# EAGLE design main (EAGLE 9.6.2)
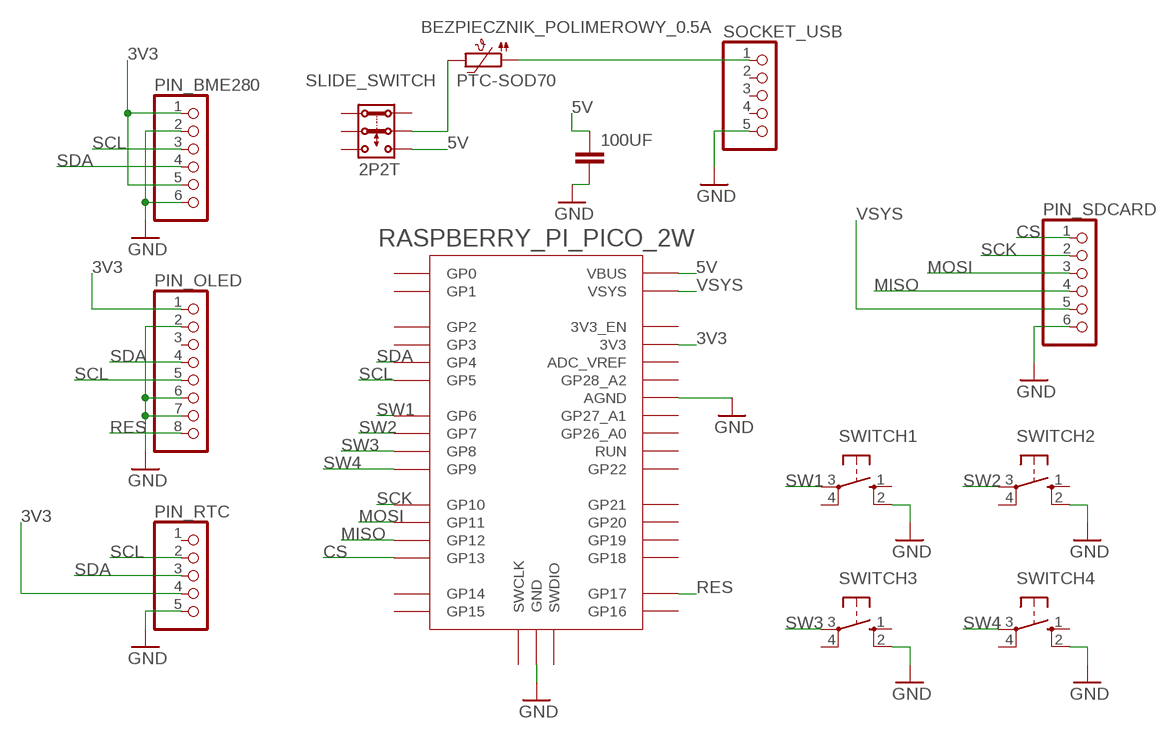
[diagram p0: schematic, sheet 1]

## Parts
100UF  C2,5-3  [C2.5-3]
BEZPIECZNIK_POLIMEROWY_0.5A  PTC-SOD70  [SOD70]
PIN_BME280  PINHD-1X6  [1X06]
PIN_OLED  PINHD-1X8  [1X08]
PIN_RTC  PINHD-1X5  [1X05]
PIN_SDCARD  PINHD-1X6  [1X06]
RASPBERRY_PI_PICO_2W  RPI_PICO-TH  [RPI_PICO_TH]
SLIDE_SWITCH  2P2T  [2P2T]
SOCKET_USB  PINHD-1X5  [1X05]
SWITCH1  10-XX  [B3F-10XX]
SWITCH2  10-XX  [B3F-10XX]
SWITCH3  10-XX  [B3F-10XX]
SWITCH4  10-XX  [B3F-10XX]

## Nets
3V3: PIN_BME280.1 PIN_BME280.5 PIN_OLED.1 PIN_RTC.4 RASPBERRY_PI_PICO_2W.3V3
5V: 100UF.1 RASPBERRY_PI_PICO_2W.VBUS SLIDE_SWITCH.3.1
CS: PIN_SDCARD.1 RASPBERRY_PI_PICO_2W.GP13
GND: 100UF.2 PIN_BME280.2 PIN_BME280.6 PIN_OLED.2 PIN_OLED.6 PIN_OLED.7 PIN_RTC.5 PIN_SDCARD.6 RASPBERRY_PI_PICO_2W.AGND RASPBERRY_PI_PICO_2W.GND@1(GND) RASPBERRY_PI_PICO_2W.GND@2(GND) RASPBERRY_PI_PICO_2W.GND@3(GND) RASPBERRY_PI_PICO_2W.GND@4(GND) RASPBERRY_PI_PICO_2W.GND@5(GND) RASPBERRY_PI_PICO_2W.GND@6(GND) RASPBERRY_PI_PICO_2W.GND@7(GND) RASPBERRY_PI_PICO_2W.GND@8(GND) SOCKET_USB.5 SWITCH1.2(S1) SWITCH2.2(S1) SWITCH3.2(S1) SWITCH4.2(S1)
MISO: PIN_SDCARD.4 RASPBERRY_PI_PICO_2W.GP12
MOSI: PIN_SDCARD.3 RASPBERRY_PI_PICO_2W.GP11
N$1: BEZPIECZNIK_POLIMEROWY_0.5A.1 SOCKET_USB.1
N$2: BEZPIECZNIK_POLIMEROWY_0.5A.2 SLIDE_SWITCH.2.1
RES: PIN_OLED.8 RASPBERRY_PI_PICO_2W.GP17
SCK: PIN_SDCARD.2 RASPBERRY_PI_PICO_2W.GP10
SCL: PIN_BME280.3 PIN_OLED.5 PIN_RTC.2 RASPBERRY_PI_PICO_2W.GP5
SDA: PIN_BME280.4 PIN_OLED.4 PIN_RTC.3 RASPBERRY_PI_PICO_2W.GP4
SW1: RASPBERRY_PI_PICO_2W.GP6 SWITCH1.3(P)
SW2: RASPBERRY_PI_PICO_2W.GP7 SWITCH2.3(P)
SW3: RASPBERRY_PI_PICO_2W.GP8 SWITCH3.3(P)
SW4: RASPBERRY_PI_PICO_2W.GP9 SWITCH4.3(P)
VSYS: PIN_SDCARD.5 RASPBERRY_PI_PICO_2W.VSYS
Unconnected: PIN_OLED.3 PIN_RTC.1 RASPBERRY_PI_PICO_2W.3V3_EN RASPBERRY_PI_PICO_2W.ADC_VREF RASPBERRY_PI_PICO_2W.GP0 RASPBERRY_PI_PICO_2W.GP1 RASPBERRY_PI_PICO_2W.GP2 RASPBERRY_PI_PICO_2W.GP3 RASPBERRY_PI_PICO_2W.GP14 RASPBERRY_PI_PICO_2W.GP15 RASPBERRY_PI_PICO_2W.GP16 RASPBERRY_PI_PICO_2W.GP18 RASPBERRY_PI_PICO_2W.GP19 RASPBERRY_PI_PICO_2W.GP20 RASPBERRY_PI_PICO_2W.GP21 RASPBERRY_PI_PICO_2W.GP22 RASPBERRY_PI_PICO_2W.GP26_A0 RASPBERRY_PI_PICO_2W.GP27_A1 RASPBERRY_PI_PICO_2W.GP28_A2 RASPBERRY_PI_PICO_2W.RUN RASPBERRY_PI_PICO_2W.SWCLK RASPBERRY_PI_PICO_2W.SWDIO SLIDE_SWITCH.1.1 SLIDE_SWITCH.1.2 SLIDE_SWITCH.2.2 SLIDE_SWITCH.3.2 SOCKET_USB.2 SOCKET_USB.3 SOCKET_USB.4 SWITCH1.1(S) SWITCH1.4(P1) SWITCH2.1(S) SWITCH2.4(P1) SWITCH3.1(S) SWITCH3.4(P1) SWITCH4.1(S) SWITCH4.4(P1)

## Library data of the parts
100UF = capacitor-wima:C: CAPACITOR naming: grid - package width
BEZPIECZNIK_POLIMEROWY_0.5A = ptc-ntc:PTC-: Positive Temperature Coefficient Resistor (PTC) termistor Philips KTY81-210 - KTY81-252 Source: 153627-da-01-en-Temperatur-Sensor_KTY10-6_Philips.pdf; OC_FARNELL: unknown; OC_NEWARK: unknown
PIN_BME280 PIN_SDCARD = pinhead:PINHD-1X6: PIN HEADER
PIN_OLED = pinhead:PINHD-1X8: PIN HEADER
PIN_RTC SOCKET_USB = pinhead:PINHD-1X5: PIN HEADER
RASPBERRY_PI_PICO_2W = RaspberryPi_Pico:RPI_PICO
SLIDE_SWITCH = switch:2P2T: SLIDE SWITCH 2P2T Part No. SS-22F05-G(A)4 Source: CANAL ELECTRONIC CO., LTD .. switsch.pdf
SWITCH1-SWITCH4 = switch-omron:10-XX: OMRON SWITCH; MPN: B3F-1000; OC_FARNELL: 176432; OC_NEWARK: 36M3542

## Board
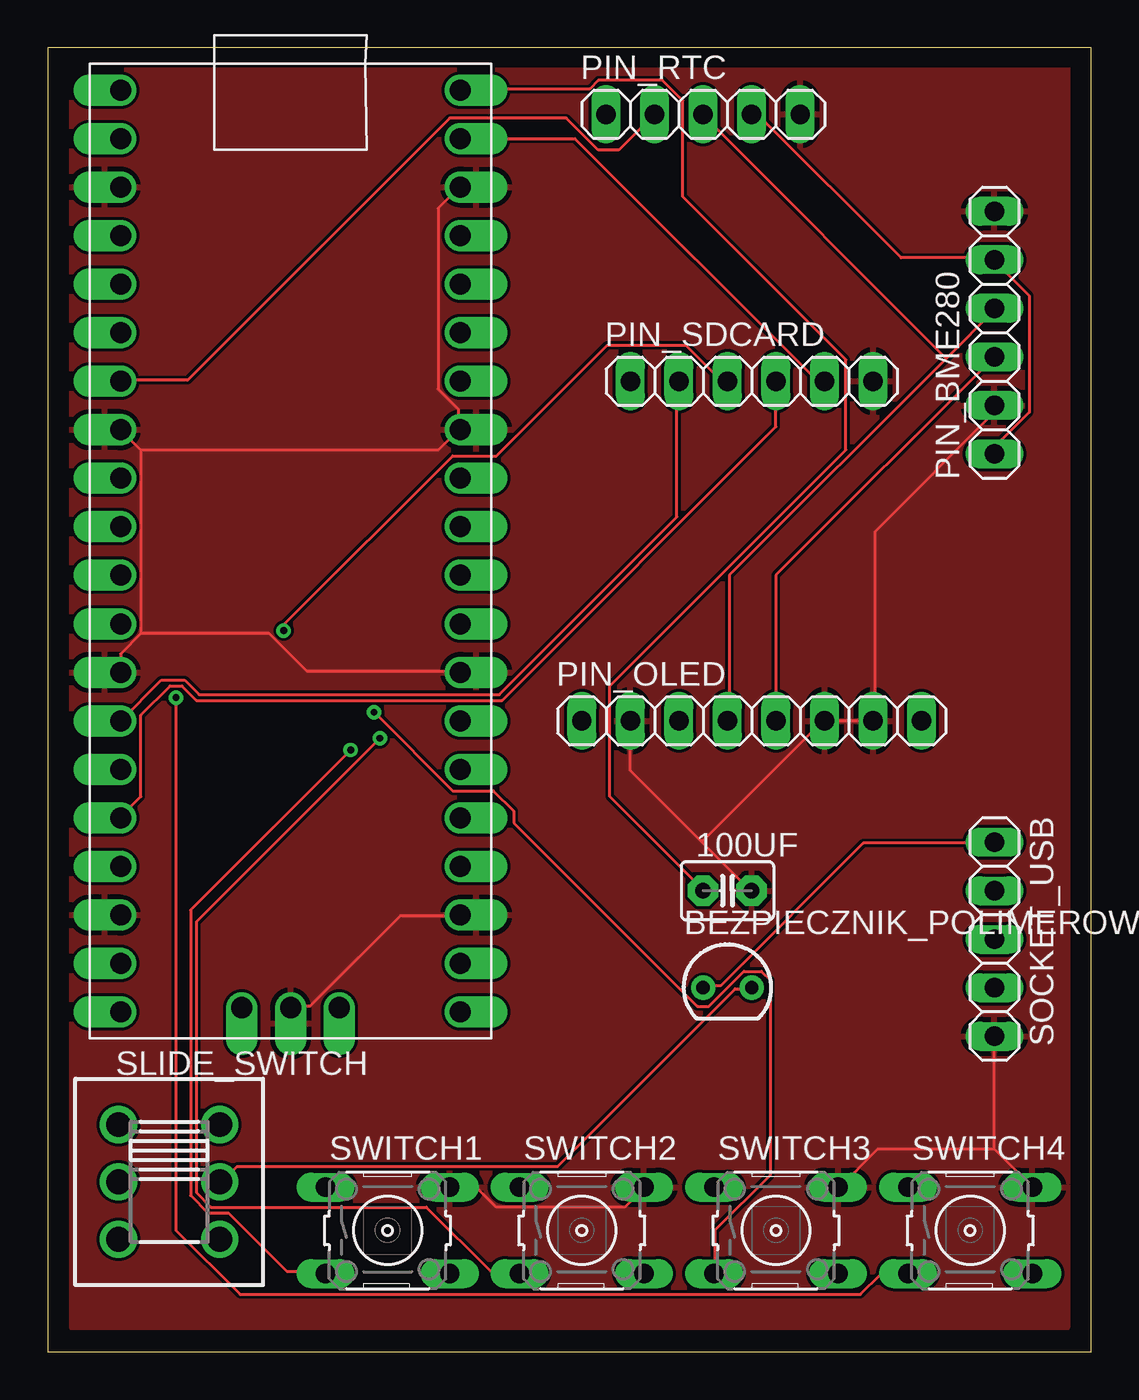
[diagram p1: board, top side]
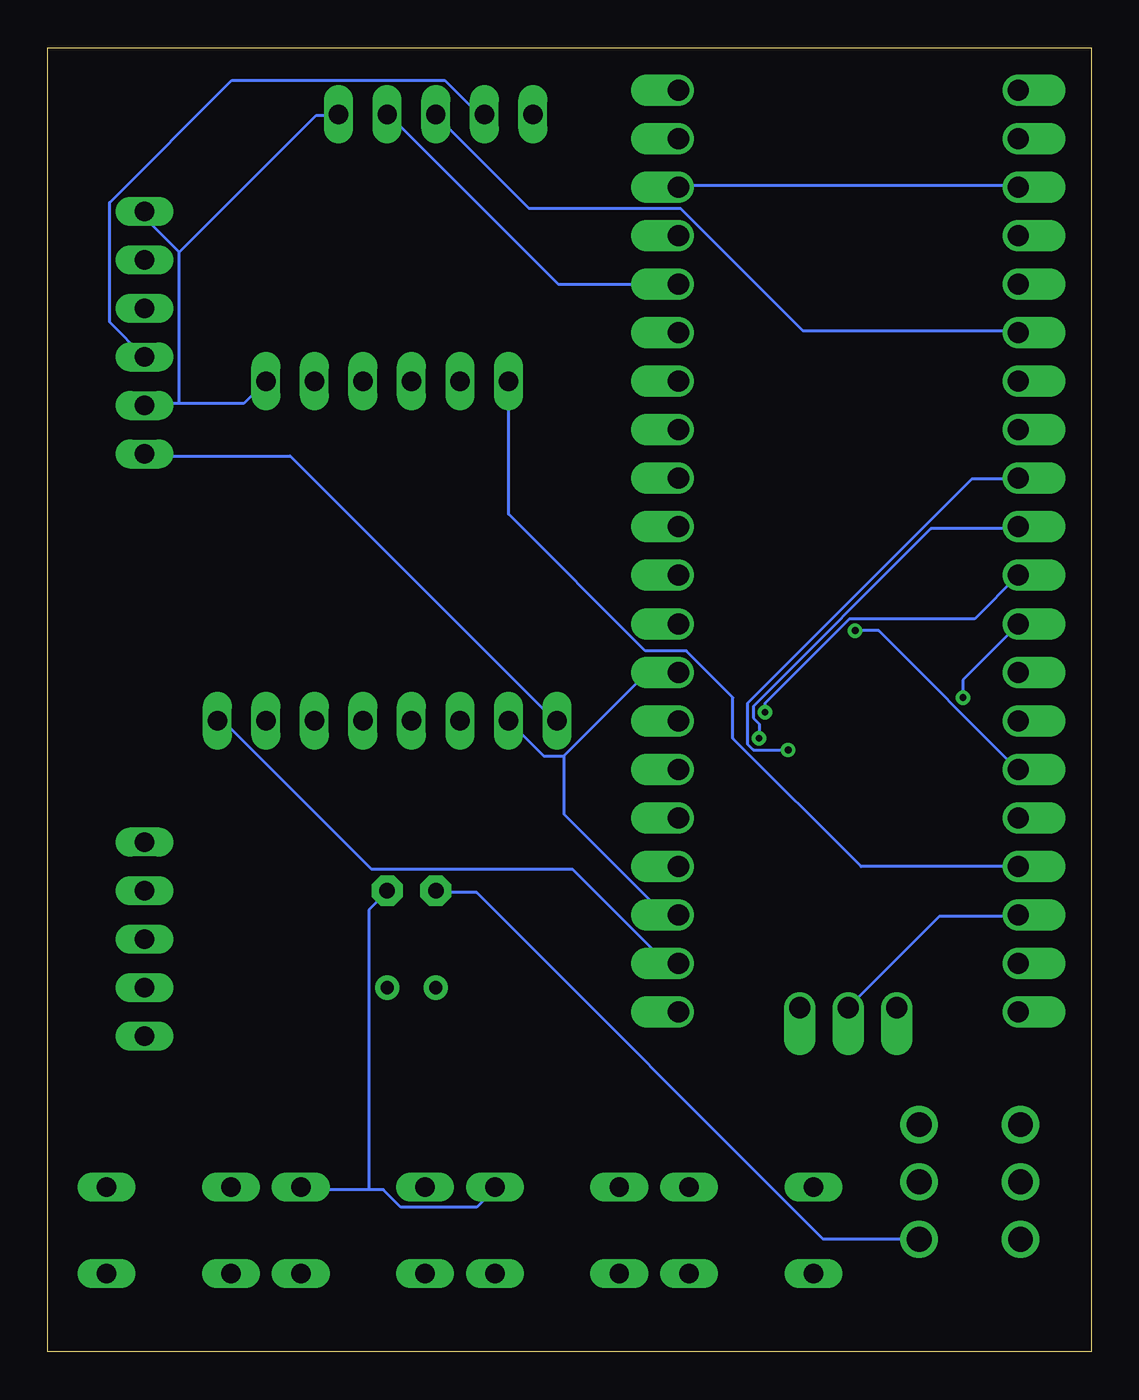
[diagram p2: board, bottom side, seen from below]

Size 54.59 x 68.25 mm. Coordinates in mm from the lower left corner, seen from the top.
Outline: 0,0 54.59,0 54.59,68.25 0,68.25 0,0
Copper layers (1*16): Top 0.035mm / dielectric 1.5mm / Bottom 0.035mm
Design rules "default": minimum track width 6mil, minimum drill 0.35mm, track to track 6mil, track to pad 6mil, pad to pad 6mil, via to via 6mil, smd to smd 6mil, copper to edge 40mil, drill to drill 6mil, minimum pad ring 10mil, minimum via ring 8mil, stop-mask expansion 4mil, vias tented up to drill 0mil, thermal gap 10mil

### Footprints (pad centres in the part's own frame; a part is rotated, then mirrored left to right if it is on the bottom)
C2.5-3 = drill 0.813 pad 1.6 octagon: 1 -1.27,0; 2 1.27,0
SOD70 = drill 0.7 pad 1.27: 1 -1.27,0; 2 1.27,0
1X06 = drill 1.016 long: 1 -6.35,0; 2 -3.81,0; 3 -1.27,0; 4 1.27,0; 5 3.81,0; 6 6.35,0
1X08 = drill 1.016 long: 1 -8.89,0; 2 -6.35,0; 3 -3.81,0; 4 -1.27,0; 5 1.27,0; 6 3.81,0; 7 6.35,0; 8 8.89,0
1X05 = drill 1.016 long: 1 -5.08,0; 2 -2.54,0; 3 0,0; 4 2.54,0; 5 5.08,0
RPI_PICO_TH = drill 1.1 pad 1.6 offset: 3V3 8.89,13.97; 3V3_EN 8.89,16.51; ADC_VREF 8.89,11.43; AGND 8.89,6.35; GND@1 -8.89,19.05; GND@2 -8.89,6.35; GND@3 -8.89,-6.35; GND@4 -8.89,-19.05; GND@5 0,-23.9; GND@6 8.89,-19.05; GND@7 8.89,-6.35; GND@8 8.89,19.05; GP0 -8.89,24.13; GP1 -8.89,21.59; GP2 -8.89,16.51; GP3 -8.89,13.97; GP4 -8.89,11.43; GP5 -8.89,8.89; GP6 -8.89,3.81; GP7 -8.89,1.27; GP8 -8.89,-1.27; GP9 -8.89,-3.81; GP10 -8.89,-8.89; GP11 -8.89,-11.43; GP12 -8.89,-13.97; GP13 -8.89,-16.51; GP14 -8.89,-21.59; GP15 -8.89,-24.13; GP16 8.89,-24.13; GP17 8.89,-21.59; GP18 8.89,-16.51; GP19 8.89,-13.97; GP20 8.89,-11.43; GP21 8.89,-8.89; GP22 8.89,-3.81; GP26_A0 8.89,1.27; GP27_A1 8.89,3.81; GP28_A2 8.89,8.89; RUN 8.89,-1.27; SWCLK -2.54,-23.9; SWDIO 2.54,-23.9; VBUS 8.89,24.13; VSYS 8.89,21.59
2P2T = drill 1.3 pad 1.93: 1.1 -3,2.65; 1.2 -3,-2.65; 2.1 0,2.65; 2.2 0,-2.65; 3.1 3,2.65; 3.2 3,-2.65
B3F-10XX = drill 1.016 long: 1 -3.251,2.261; 2 3.251,2.261; 3 -3.251,-2.261; 4 3.251,-2.261

### Placement (x,y rotation side)
100UF  35.56,24.13 0 top
BEZPIECZNIK_POLIMEROWY_0.5A  35.56,19.05 0 top
PIN_BME280  49.53,53.34 90 top
PIN_OLED  36.83,33.02 0 top
PIN_RTC  34.29,64.77 0 top
PIN_SDCARD  36.83,50.8 0 top
RASPBERRY_PI_PICO_2W  12.7,41.91 0 top
SLIDE_SWITCH  6.35,8.89 270 top
SOCKET_USB  49.53,21.59 270 top
SWITCH1  17.78,6.35 0 top
SWITCH2  27.94,6.35 0 top
SWITCH3  38.1,6.35 0 top
SWITCH4  48.26,6.35 0 top

### Tracks (layer width: path | path; a pad name or v marks a point on that pad's centre or on a via)
3V3
  Top 0.152: PIN_RTC.4 36.88,64.72 37.19,64.72 44.65,57.25 49.53,57.25 PIN_BME280.5 49.53,57.1 51.36,55.27 51.36,49.17 49.53,47.35 PIN_BME280.1
  Bottom 0.152: PIN_OLED.1 28.04,33.02 41.91,46.89 49.53,46.89 PIN_BME280.1 | RASPBERRY_PI_PICO_2W.3V3 27.89,55.88 36.73,64.72 PIN_RTC.4
5V
  Top 0.152: RASPBERRY_PI_PICO_2W.VBUS 21.64,66.09 28.35,66.09 28.8,66.55 32.16,66.55 33.22,65.48 33.22,60.45 41.76,51.92 41.76,47.19 29.41,34.85 29.41,29.06 34.29,24.18 100UF.1
  Bottom 0.152: 100UF.1 34.29,24.03 32.16,24.03 14.02,5.89 9.14,5.89 SLIDE_SWITCH.3.1
CS
  Bottom 0.152: PIN_SDCARD.1 30.48,43.84 23.32,36.68 21.18,36.68 18.75,34.24 18.75,32.11 12.04,25.4 RASPBERRY_PI_PICO_2W.GP13
GND
  Top 0.152: RASPBERRY_PI_PICO_2W.GND@3 3.81,36.53 4.88,37.59 | 4.88,47.19 4.88,37.59 | RASPBERRY_PI_PICO_2W.GND@2 4.88,47.19 | 21.49,48.26 21.49,49.33 20.42,50.39 20.42,59.84 21.49,60.91 RASPBERRY_PI_PICO_2W.GND@8 | 4.88,47.19 20.42,47.19 21.49,48.26 | 21.49,48.26 RASPBERRY_PI_PICO_2W.AGND | 49.53,10.62 SOCKET_USB.5 | 49.53,10.62 51.51,8.64 SWITCH4.2 | SWITCH1.2 21.03,8.48 22.55,8.48 23.47,7.57 30.18,7.57 31.09,8.48 SWITCH2.2 | 49.53,10.62 43.43,10.62 41.45,8.64 SWITCH3.2 | RASPBERRY_PI_PICO_2W.GND@5 12.8,18.09 13.72,18.09 18.44,22.81 21.49,22.81 RASPBERRY_PI_PICO_2W.GND@6 | PIN_OLED.2 30.48,30.43 34.14,26.77 | 34.14,26.77 36.73,24.18 100UF.2 | 34.14,26.77 34.29,26.77 40.54,33.02 PIN_OLED.6 PIN_OLED.7 43.28,33.02 43.28,42.93 49.53,49.17 PIN_BME280.2 | 4.88,37.59 11.58,37.59 13.56,35.61 21.49,35.61 RASPBERRY_PI_PICO_2W.GND@7
  Bottom 0.152: RASPBERRY_PI_PICO_2W.GND@1 3.81,61.06 21.49,61.06 RASPBERRY_PI_PICO_2W.GND@8 | 37.8,8.48 37.03,8.48 36.12,7.57 32.16,7.57 31.24,8.48 SWITCH2.2 | 37.8,8.48 41.3,8.48 SWITCH3.2 | 47.7,49.63 44.35,49.63 PIN_SDCARD.6 | 47.7,49.63 49.53,49.63 PIN_BME280.2 | PIN_BME280.6 49.53,59.39 47.7,57.56 | 47.7,49.63 47.7,57.56 | 47.7,57.56 40.54,64.72 39.47,64.72 PIN_RTC.5 | RASPBERRY_PI_PICO_2W.GND@4 3.81,22.81 7.92,22.81 12.65,18.09 RASPBERRY_PI_PICO_2W.GND@5 | 27.58,31.19 23.32,35.46 21.64,35.46 RASPBERRY_PI_PICO_2W.GND@7 | 27.58,31.19 28.65,31.19 PIN_OLED.2 | 27.58,31.19 27.58,28.14 22.4,22.96 21.64,22.96 RASPBERRY_PI_PICO_2W.GND@6 | 37.8,8.48 37.8,23.11 36.88,24.03 100UF.2
  pour Top: 1.27,67.31 53.34,67.31 53.34,1.27 1.27,1.27
MISO
  Top 0.152: PIN_SDCARD.4 38.1,48.41 23.77,34.09 7.77,34.09 7.01,34.85 6.4,34.85 4.88,33.33 4.88,29.06 3.81,27.99 RASPBERRY_PI_PICO_2W.GP12
MOSI  (via drill 0.35)
  Top 0.152: v12.34,37.74 12.34,38.05 21.18,46.89 23.47,46.89 29.26,52.68 33.38,52.68 35.2,50.85 35.51,50.85 PIN_SDCARD.3
  Bottom 0.152: v12.34,37.74 11.12,37.74 3.81,30.43 RASPBERRY_PI_PICO_2W.GP11
N$1
  Top 0.152: BEZPIECZNIK_POLIMEROWY_0.5A.1 34.29,19.15 35.2,19.15 42.67,26.62 49.53,26.62 SOCKET_USB.1
N$2
  Top 0.152: BEZPIECZNIK_POLIMEROWY_0.5A.2 36.73,19 35.97,19 26.67,9.7 9.91,9.7 9.14,8.94 SLIDE_SWITCH.2.1
RES
  Bottom 0.152: PIN_OLED.8 45.41,33.02 37.64,25.25 27.13,25.25 22.25,20.37 21.64,20.37 RASPBERRY_PI_PICO_2W.GP17
SCK
  Top 0.152: RASPBERRY_PI_PICO_2W.GP10 5.94,35.15 7.16,35.15 7.92,34.39 23.62,34.39 32.92,43.69 32.92,50.7 PIN_SDCARD.2
SCL
  Top 0.152: PIN_OLED.5 38.1,40.64 PIN_BME280.3 | PIN_RTC.2 29.87,62.89 28.8,62.89 27.13,64.57 21.03,64.57 7.32,50.85 3.81,50.85 RASPBERRY_PI_PICO_2W.GP5
  Bottom 0.152: PIN_BME280.3 51.36,53.9 51.36,60.15 44.96,66.55 33.83,66.55 32.16,64.87 31.85,64.87 PIN_RTC.2
SDA
  Top 0.152: 47.09,52.07 49.53,54.51 PIN_BME280.4 | 47.09,52.07 35.66,40.64 35.66,33.02 PIN_OLED.4 | 47.09,52.07 46.94,52.07 34.29,64.72 PIN_RTC.3
  Bottom 0.152: RASPBERRY_PI_PICO_2W.GP4 3.81,53.44 15.09,53.44 21.49,59.84 29.41,59.84 34.29,64.72 PIN_RTC.3
SW1  (via drill 0.35)
  Top 0.152: v15.85,31.5 7.47,23.11 7.47,8.18 8.38,7.26 9.45,7.26 12.5,4.22 14.48,4.22 SWITCH1.3
  Bottom 0.152: v15.85,31.5 17.68,31.5 17.98,31.8 17.98,33.93 6.25,45.67 3.81,45.67 RASPBERRY_PI_PICO_2W.GP6
SW2  (via drill 0.35)
  Top 0.152: v17.37,32.11 7.77,22.5 7.77,8.33 8.53,7.57 19.81,7.57 23.16,4.22 24.69,4.22 SWITCH2.3
  Bottom 0.152: v17.37,32.11 17.37,32.87 17.68,33.17 17.68,33.78 8.38,43.08 3.81,43.08 RASPBERRY_PI_PICO_2W.GP7
SW3  (via drill 0.35)
  Top 0.152: v17.07,33.48 21.18,29.36 23.32,29.36 24.38,28.3 24.38,27.69 33.98,18.09 34.59,18.09 36.42,19.91 37.34,19.91 37.8,19.46 37.8,9.25 34.9,6.35 34.9,4.22 SWITCH3.3
  Bottom 0.152: v17.07,33.48 17.07,33.93 12.65,38.35 6.1,38.35 RASPBERRY_PI_PICO_2W.GP8
SW4  (via drill 0.35)
  Top 0.152: v6.71,34.24 6.71,6.35 10.06,3 42.52,3 43.59,4.06 44.96,4.06 SWITCH4.3
  Bottom 0.152: v6.71,34.24 6.71,35.15 3.81,38.05 RASPBERRY_PI_PICO_2W.GP9
VSYS
  Top 0.152: RASPBERRY_PI_PICO_2W.VSYS 27.58,63.5 40.23,50.85 40.54,50.85 PIN_SDCARD.5